# Altium schematic sheet PCB_Project.SchDoc
size A4
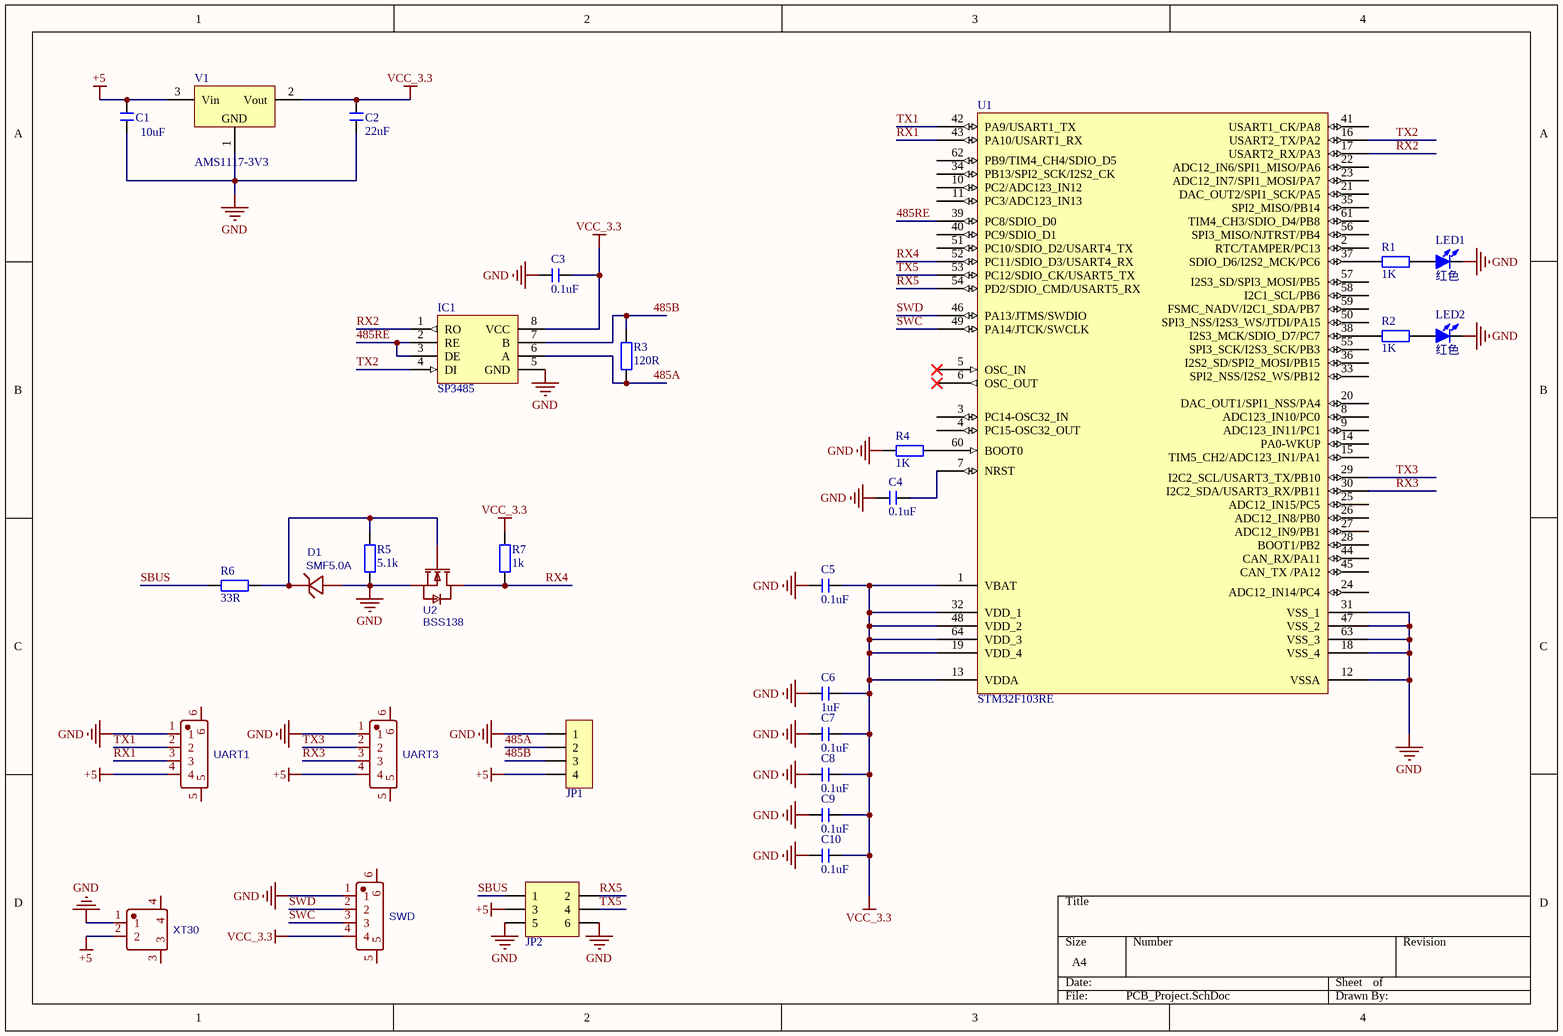
[diagram p0: PCB_Project.SchDoc]

## Parts
C1  10uF  [C 0805_L]
C2  22uF  [C 0805_L]
C3  0.1uF  [C 0805_L]
C4  0.1uF  [C 0805_L]
C5  0.1uF  [C 0805_L]
C6  1uF  [C 0805_L]
C7  0.1uF  [C 0805_L]
C8  0.1uF  [C 0805_L]
C9  0.1uF  [C 0805_L]
C10  0.1uF  [C 0805_L]
D1  SMF5.0A  [SOD-123FL_L2.8-W1.8-LS3.8-RD]
IC1  SP3485  [SOP8_N]
JP1  HDR-1X4  [HDR2.54-LI-4P]  (value not drawn)
JP2  Header3X2  [HDR2.54-LI-2x3P]  (value not drawn)
LED1  红色  [LED 0805G]
LED2  红色  [LED 0805G]
R1  1K  [R 0805_L]
R2  1K  [R 0805_L]
R3  120R  [R 0805_L]
R4  1K  [R 0805_L]
R5  5.1k  [R 0805_L]
R6  33R  [R 0805_L]
R7  1k  [R 0805_L]
SWD  (no value)  [CONN-SMD_4P-P1.00_HDGC_HDGC1002WR-S-4P]
U1  STM32F103RE  [LQFP64 10X10_N]
U2  BSS138  [SOT-23-3_L2.9-W1.3-P1.90-LS2.6-BR]
UART1  (no value)  [CONN-SMD_4P-P1.00_HDGC_HDGC1002WR-S-4P]
UART3  (no value)  [CONN-SMD_4P-P1.00_HDGC_HDGC1002WR-S-4P]
V1  AMS1117-3V3  [SOT89_M]
XT30  (no value)  [CONN-TH_XT30PW-M]

## Nets
+5: C1.2 JP1.4 JP2.3 UART1.4 UART3.4 V1.3(Vin) XT30.2
GND: C1.1 C2.1 C3.1 C4.1 C5.1 C6.1 C7.1 C8.1 C9.1 C10.1 D1.2(A) IC1.5(GND) JP1.1 JP2.5 JP2.6 LED1.2(K) LED2.2(K) R4.1 R5.1 SWD.1 U1.12(VSSA) U1.18(VSS_4) U1.31(VSS_1) U1.47(VSS_2) U1.63(VSS_3) U2.2(S) UART1.1 UART3.1 V1.1(GND) XT30.1
VCC_3.3: C2.2 C3.2 C5.2 C6.2 C7.2 C8.2 C9.2 C10.2 IC1.8(VCC) R7.2 SWD.4 U1.1(VBAT) U1.13(VDDA) U1.19(VDD_4) U1.32(VDD_1) U1.48(VDD_2) U1.64(VDD_3) V1.2(Vout)
485A: IC1.6(A) JP1.2 R3.1
485B: IC1.7(B) JP1.3 R3.2
485RE: IC1.2(RE) IC1.3(DE) U1.39(PC8/SDIO_D0)
RX1: U1.43(PA10/USART1_RX) UART1.3
RX2: IC1.1(RO) U1.17(USART2_RX/PA3)
RX3: U1.30(I2C2_SDA/USART3_RX/PB11) UART3.3
RX4: R7.1 U1.52(PC11/SDIO_D3/USART4_RX) U2.3(D)
RX5: JP2.2 U1.54(PD2/SDIO_CMD/USART5_RX)
SBUS: JP2.1 R6.2
SWC: SWD.3 U1.49(PA14/JTCK/SWCLK)
SWD: SWD.2 U1.46(PA13/JTMS/SWDIO)
TX1: U1.42(PA9/USART1_TX) UART1.2
TX2: IC1.4(DI) U1.16(USART2_TX/PA2)
TX3: U1.29(I2C2_SCL/USART3_TX/PB10) UART3.2
TX5: JP2.4 U1.53(PC12/SDIO_CK/USART5_TX)
NetC4_2: C4.2 U1.7(NRST)
NetD1_1: D1.1(C) R5.2 R6.1 U2.1(G)
NetLED1_1: LED1.1(A) R1.2
NetLED2_1: LED2.1(A) R2.2
NetR1_1: R1.1 U1.37(SDIO_D6/I2S2_MCK/PC6)
NetR2_1: R2.1 U1.38(I2S3_MCK/SDIO_D7/PC7)
NetR4_2: R4.2 U1.60(BOOT0)

Not connected (* = marked no-connect by the designer): SWD 5 6; U1 2(RTC/TAMPER/PC13) 3(PC14-OSC32_IN) 4(PC15-OSC32_OUT) 5(OSC_IN)* 6(OSC_OUT)* 8(ADC123_IN10/PC0) 9(ADC123_IN11/PC1) 10(PC2/ADC123_IN12) 11(PC3/ADC123_IN13) 14(PA0-WKUP) 15(TIM5_CH2/ADC123_IN1/PA1) 20(DAC_OUT1/SPI1_NSS/PA4) 21(DAC_OUT2/SPI1_SCK/PA5) 22(ADC12_IN6/SPI1_MISO/PA6) 23(ADC12_IN7/SPI1_MOSI/PA7) 24(ADC12_IN14/PC4) 25(ADC12_IN15/PC5) 26(ADC12_IN8/PB0) 27(ADC12_IN9/PB1) 28(BOOT1/PB2) 33(SPI2_NSS/I2S2_WS/PB12) 34(PB13/SPI2_SCK/I2S2_CK) 35(SPI2_MISO/PB14) 36(I2S2_SD/SPI2_MOSI/PB15) 40(PC9/SDIO_D1) 41(USART1_CK/PA8) 44(CAN_RX/PA11) 45(CAN_TX_/PA12) 50(SPI3_NSS/I2S3_WS/JTDI/PA15) 51(PC10/SDIO_D2/USART4_TX) 55(SPI3_SCK/I2S3_SCK/PB3) 56(SPI3_MISO/NJTRST/PB4) 57(I2S3_SD/SPI3_MOSI/PB5) 58(I2C1_SCL/PB6) 59(FSMC_NADV/I2C1_SDA/PB7) 61(TIM4_CH3/SDIO_D4/PB8) 62(PB9/TIM4_CH4/SDIO_D5); UART1 5 6; UART3 5 6; XT30 3 4

## Library data of the parts
C1-C10 = C: 无极性贴片电容; 版权归属: 源创客; BOM名称: 无极性贴片电容; 学习资源: www.ooocke.com
D1 = SMF5.0A_C2836403: BOM_Manufacturer: MSKSEMI(美森科); Contributor: LCSC; BOM_Supplier: LCSC; BOM_Supplier Part: C2836403; BOM_Manufacturer Part: SMF5.0A; BOM_JLCPCB Part Class: Extended Part; spicePre: D; spiceSymbolName: SMF5.0A_C2836403
IC1 = SP3485: RS485总线收发芯片; 版权归属: 源创客; BOM名称: RS485总线收发芯片; 学习资源: www.ooocke.com
JP1 = Header 4: 4P接插件; 版权归属: 源创客; BOM名称: 4P接插件; 学习资源: www.ooocke.com
JP2 = Header 3X2: 3*2P接插件; 版权归属: 源创客; BOM名称: 3*2P接插件; 学习资源: www.ooocke.com
LED1 LED2 = LED-SMD: 贴片LED; 版权归属: 源创客; BOM名称: 贴片LED; 学习资源: www.ooocke.com
R1-R7 = R: 贴片电阻; 版权归属: 源创客; BOM名称: 贴片电阻; 学习资源: www.ooocke.com
SWD UART1 UART3 = HDGC1002WR-S-4P: BOM_Manufacturer: HDGC(华德共创); Contributor: LCSC; BOM_Supplier: LCSC; BOM_Supplier Part: C2936214; BOM_Manufacturer Part: HDGC1002WR-S-4P; BOM_JLCPCB Part Class: Extended Part; spicePre: C; spiceSymbolName: HDGC1002WR-S-4P
U1 = STM32F103RE: 32位STM单片机; 版权归属: 源创客; BOM名称: 32位STM单片机; 学习资源: www.ooocke.com
U2 = BSS138_C3015220: BOM_Manufacturer: KUU; Contributor: lcsc; BOM_Supplier: LCSC; BOM_Supplier Part: C3015220; BOM_Manufacturer Part: BSS138; link: https://atta.szlcsc.com/upload/public/pdf/source/20220516/125DEF07DB3AB32C02C9AD402DEFFF8E.pdf; spicePre: U; spiceSymbolName: BSS138_C3015220
V1 = AMS1117: 三端稳压芯片; BOM名称: 稳压芯片; 版权归属: 源创客; 学习资源: www.ooocke.com
XT30 = XT30PW-M: BOM_Manufacturer: Changzhou Amass Elec; Contributor: LCSC; BOM_Supplier: LCSC; BOM_Supplier Part: C431092; BOM_Manufacturer Part: XT30PW-M; BOM_JLCPCB Part Class: Extended Part; spicePre: C; spiceSymbolName: XT30PW-M